# Altium schematic sheet OpenVLC_1_3_2.SchDoc
size A4; SheetNumber: 1; SheetTotal: 1
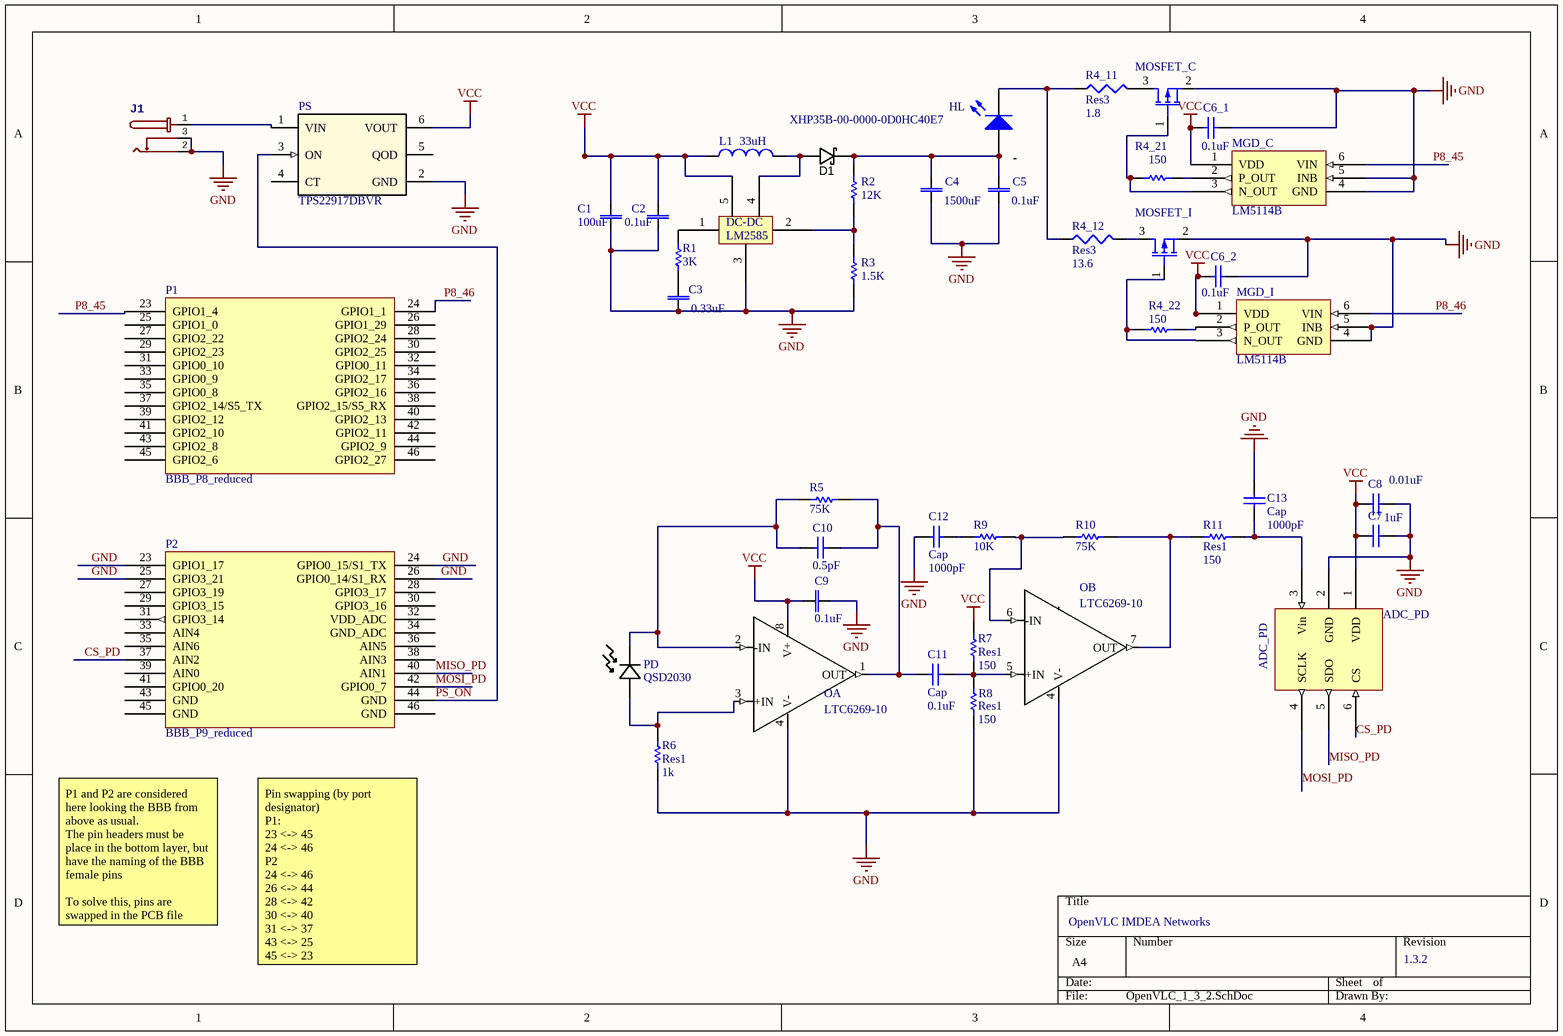
[diagram p0: OpenVLC_1_3_2.SchDoc]

## Parts
ADC_PD  ADC_PD  [SOT23-6]
C1  value 100uF  [WCAP-ATG8 6.3x11x2.5x0.5]  (hidden comment: Cap)
C2  value 0.1uF  [1608[0603]]  (hidden comment: Cap)
C3  value 0.33uF  [1608[0603]]  (hidden comment: Cap)
C4  value 1500uF  [WCAP-ATG8 10x12.5x5x0.6]  (hidden comment: Cap)
C5  value 0.1uF  [1608[0603]]  (hidden comment: Cap)
C6_1  value 0.1uF  [1608[0603]]  (hidden comment: Cap)
C6_2  value 0.1uF  [1608[0603]]  (hidden comment: Cap)
C7  value 1uF  [1608[0603]]  (hidden comment: Cap)
C8  value 0.01uF  [1608[0603]]  (hidden comment: Cap)
C9  value 0.1uF  [1608[0603]]  (hidden comment: Cap)
C10  value 0.5pF  [1608[0603]]  (hidden comment: Cap)
C11  Cap  value 0.1uF  [1608[0603]]
C12  Cap  value 1000pF  [1608[0603]]
C13  Cap  value 1000pF  [1608[0603]]
D1  (no value)  [DO-214AC]
DC-DC  LM2585  [TO-263-5]
HL  XHP35B-00-0000-0D0HC40E7  [LEDM345X345X226]
J1  2.0 mm Center Pin, 2.5 A, Right Angle, Through Hole, Tapered Pins, Dc Power Jack Connector  [CUI_PJ-102A]  (value not drawn)
L1  value 33uH  [WCAP-ATG8 8x16x5x0.5]  (hidden comment: Inductor)
MGD_C  LM5114B  [SOT23-6_N]
MGD_I  LM5114B  [SOT23-6_N]
MOSFET_C  MOSFET  [SOT23-3]  (value not drawn)
MOSFET_I  MOSFET  [SOT23-3]  (value not drawn)
O  LTC6269-10  [SM8]  (parts A,B of 2)
P1  BBB_P8_reduced  [BBB_CAPE_NO_HEADER_R_24]
P2  BBB_P9_reduced  [BBB_CAPE_NO_HEADER_R_24]
PD  QSD2030  [LED_T-1_34_100CF_OSI]
PS  TPS22917DBVR  [DBV0006_N]
R1  value 3K  [1608[0603]]  (hidden comment: Res Semi)
R2  value 12K  [1608[0603]]  (hidden comment: Res1)
R3  value 1.5K  [1608[0603]]  (hidden comment: Res1)
R4_11  Res3  value 1.8  [14-1210]
R4_12  Res3  value 13.6  [C1206]
R4_21  value 150  [1608[0603]]  (hidden comment: Res1)
R4_22  value 150  [1608[0603]]  (hidden comment: Res1)
R5  value 75K  [1608[0603]]  (hidden comment: Res1)
R6  Res1  value 1k  [1608[0603]]
R7  Res1  value 150  [1608[0603]]
R8  Res1  value 150  [1608[0603]]
R9  value 10K  [1608[0603]]  (hidden comment: Res1)
R10  value 75K  [1608[0603]]  (hidden comment: Res1)
R11  Res1  value 150  [1608[0603]]

## Nets
GND: ADC_PD.2(GND) C1.2 C2.2 C3.2 C4.2 C5.2 C6_1.2 C6_2.2 C7.2 C8.2 C9.1 C12.1 C13.2 DC-DC.3(GND) J1.2 J1.3 MGD_C.4(GND) MGD_C.5(INB) MGD_I.4(GND) MGD_I.5(INB) MOSFET_C.2(S) MOSFET_I.2(S) O.4(V-) P2.23(GPIO1_17) P2.24(GPIO0_15/S1_TX) P2.25(GPIO3_21) P2.26(GPIO0_14/S1_RX) PS.2(GND) R3.1 R6.1 R8.1
VCC: ADC_PD.1(VDD) C1.1 C2.1 C6_1.1 C6_2.1 C7.1 C8.1 C9.2 DC-DC.5(Vin) L1.1 MGD_C.1(VDD) MGD_I.1(VDD) O.8(V+) PS.6(VOUT) R7.2
CS_PD: ADC_PD.6(CS) P2.37(AIN2)
MISO_PD: ADC_PD.5(SDO) P2.40(AIN1)
MOSI_PD: ADC_PD.4(SCLK) P2.42(GPIO0_7)
P8_45: MGD_C.6(VIN) P1.23(GPIO1_4)
P8_46: MGD_I.6(VIN) P1.24(GPIO1_1)
PS_ON: P2.44(GND) PS.3(ON)
NetADC_PD_3: ADC_PD.3(Vin) C13.1 R11.1
NetC3_1: C3.1 R1.1
NetC4_1: C4.1 C5.1 D1.K HL.1(A) R2.2
NetC10_1: C10.1 O.2(-IN) PD.1(CATHODE) R5.1
NetC10_2: C10.2 C11.1 O.1(OUT) R5.2
NetC11_2: C11.2 O.5(+IN) R7.1 R8.2
NetC12_2: C12.2 R9.2
NetD1_A: D1.A DC-DC.4(Switch) L1.2
NetDC-DC_1: DC-DC.1(Comp) R1.2
NetDC-DC_2: DC-DC.2(Feedack) R2.1 R3.2
NetHL_2: HL.2(K) R4_11.1 R4_12.1
NetJ1_1: J1.1 PS.1(VIN)
NetMGD_C_2: MGD_C.2(P_OUT) R4_21.2
NetMGD_C_3: MGD_C.3(N_OUT) MOSFET_C.1(G) R4_21.1
NetMGD_I_2: MGD_I.2(P_OUT) R4_22.2
NetMGD_I_3: MGD_I.3(N_OUT) MOSFET_I.1(G) R4_22.1
NetMOSFET_C_3: MOSFET_C.3(D) R4_11.2
NetMOSFET_I_3: MOSFET_I.3(D) R4_12.2
NetO_3: O.3(+IN) PD.2(ANODE) R6.2
NetO_6: O.6(-IN) R9.1 R10.2
NetO_7: O.7(OUT) R10.1 R11.2

Not connected (* = marked no-connect by the designer): HL 3(Thermal); P1 25(GPIO1_0) 26(GPIO1_29) 27(GPIO2_22) 28(GPIO2_24) 29(GPIO2_23) 30(GPIO2_25) 31(GPIO0_10) 32(GPIO0_11) 33(GPIO0_9) 34(GPIO2_17) 35(GPIO0_8) 36(GPIO2_16) 37(GPIO2_14/S5_TX) 38(GPIO2_15/S5_RX) 39(GPIO2_12) 40(GPIO2_13) 41(GPIO2_10) 42(GPIO2_11) 43(GPIO2_8) 44(GPIO2_9) 45(GPIO2_6) 46(GPIO2_27); P2 27(GPIO3_19) 28(GPIO3_17) 29(GPIO3_15) 30(GPIO3_16) 31(GPIO3_14) 32(VDD_ADC) 33(AIN4) 34(GND_ADC) 35(AIN6) 36(AIN5) 38(AIN3) 39(AIN0) 41(GPIO0_20) 43(GND) 45(GND) 46(GND); PS 4(CT) 5(QOD)

## Notes on the sheet
- P1 and P2 are considered here looking the BBB from above as usual.
  The pin headers must be place in the bottom layer, but have the naming of the BBB female pins
  To solve this, pins are swapped in the PCB file
- Pin swapping (by port designator)
  P1:
  23 <-> 45
  24 <-> 46
  P2
  24 <-> 46
  26 <-> 44
  28 <-> 42
  30 <-> 40
  31 <-> 37
  43 <-> 25
  45 <-> 23
- OpenVLC IMDEA Networks
- 1.3.2

## Library data of the parts
ADC_PD = ADS7883
C1-C5 C6_1 C6_2 C7-C13 = Cap: Capacitor; Published: 8-Jun-2000; LatestRevisionDate: 17-Jul-2002; LatestRevisionNote: Re-released for DXP Platform.; PackageReference: RAD-0.3; Publisher: Altium Limited
  C6_1 C6_2 C7 C8 C10-C13: PackageDescription: Radial Cap, Thru-Hole; 2 Leads; 0.3 in Pin Spacing
D1 = DIODE_SCHOTTKY_10MQ100NPBF: Diode Schottky SMD 100V 2A SMA; Manufacturer 1: Micro Commercial Co; Manufacturer Part Number 1: SS210-TP; Material: Si; Speed: Fast Recovery =< 500ns, > 200mA (Io); SCDType: source; Ratings: 100V; 2A; Package / Case: DO-214AC, SMA; Diode Type: Schottky; Mounting Type: Surface Mount; Supplier 1: Digi-Key; Supplier Part Number 1: SS210-TPMSCT-ND
HL = LED1: Published: 8-Jun-2000; LatestRevisionDate: 08-Jul-2005; LatestRevisionNote: Mech Layer 1 removed.; PackageReference: LED-1; Publisher: Altium Limited; PackageDescription: LED; 2 Leads
J1 = PJ-102A: MF: CUI; MP: PJ-102A; Price: 0.41 USD; Package: None; Availability: Good
L1 = Inductor: Code_IEC: 1005; Published: 8-Jun-2000; LatestRevisionDate: 29-May-2009; LatestRevisionNote: IPC-7351 Footprint Added.; PackageReference: 0402-A; Publisher: Altium Limited; PackageDescription: Chip Inductor; Code_JEITA: 0402
MGD_C MGD_I = LM5114B: MOSFET Gate Driver
MOSFET_C MOSFET_I = MOSFET-P: P-Channel MOSFET; Published: 8-Jun-2000; LatestRevisionDate: 17-Jul-2002; LatestRevisionNote: Re-released for DXP Platform.; PackageVersion: 1995/1996; PackageReference: E3; Publisher: Altium Limited
PD = QSD2030: No Description Available; Mfr_Name: onsemi
PS = TPS22917DBVR: Power Switch 1.7-5.5V; Mfr_Name: Texas Instruments; TYPE: TYPE; RefDes: RefDes
R1 = Res Semi: Semiconductor Resistor; Published: 8-Jun-2000; LatestRevisionDate: 17-Jul-2002; LatestRevisionNote: Re-released for DXP Platform.; PackageReference: AXIAL-0.5; Publisher: Altium Limited
R2 R3 R4_21 R4_22 R5-R11 = Res1: Resistor; Published: 8-Jun-2000; LatestRevisionDate: 17-Jul-2002; LatestRevisionNote: Re-released for DXP Platform.; PackageReference: AXIAL-0.3; Publisher: Altium Limited; PackageDescription: Axial Device, Thru-Hole; 2 Leads; 0.3 in Pin Spacing
R4_11 R4_12 = Res3: Resistor; Published: 8-Jun-2000; LatestRevisionDate: 29-May-2009; LatestRevisionNote: IPC-7351 Footprint Added.; PackageReference: J1-0603; Publisher: Altium Limited; PackageDescription: Chip Resistor